# Altium schematic sheet 主控板20160428.SchDoc
size A1
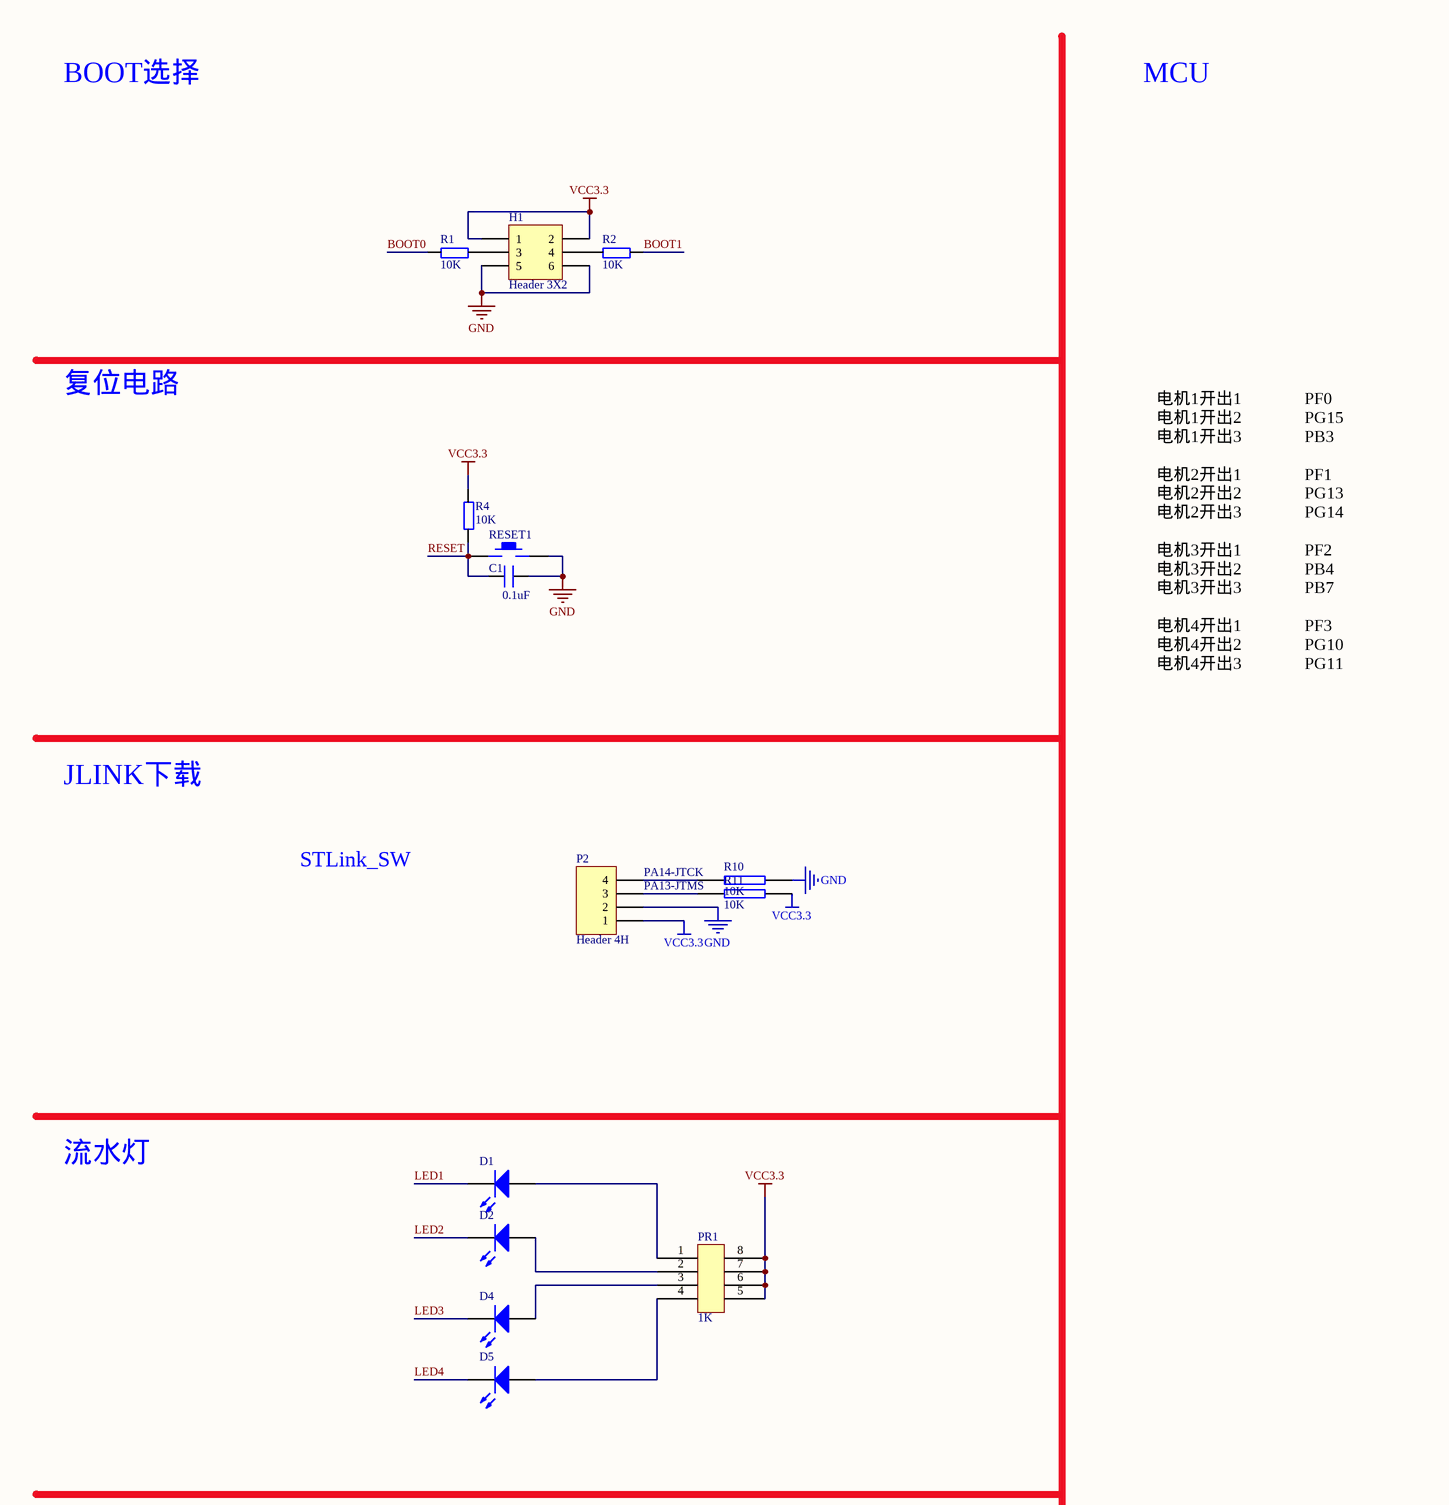
[diagram p0: 主控板20160428.SchDoc, top left]
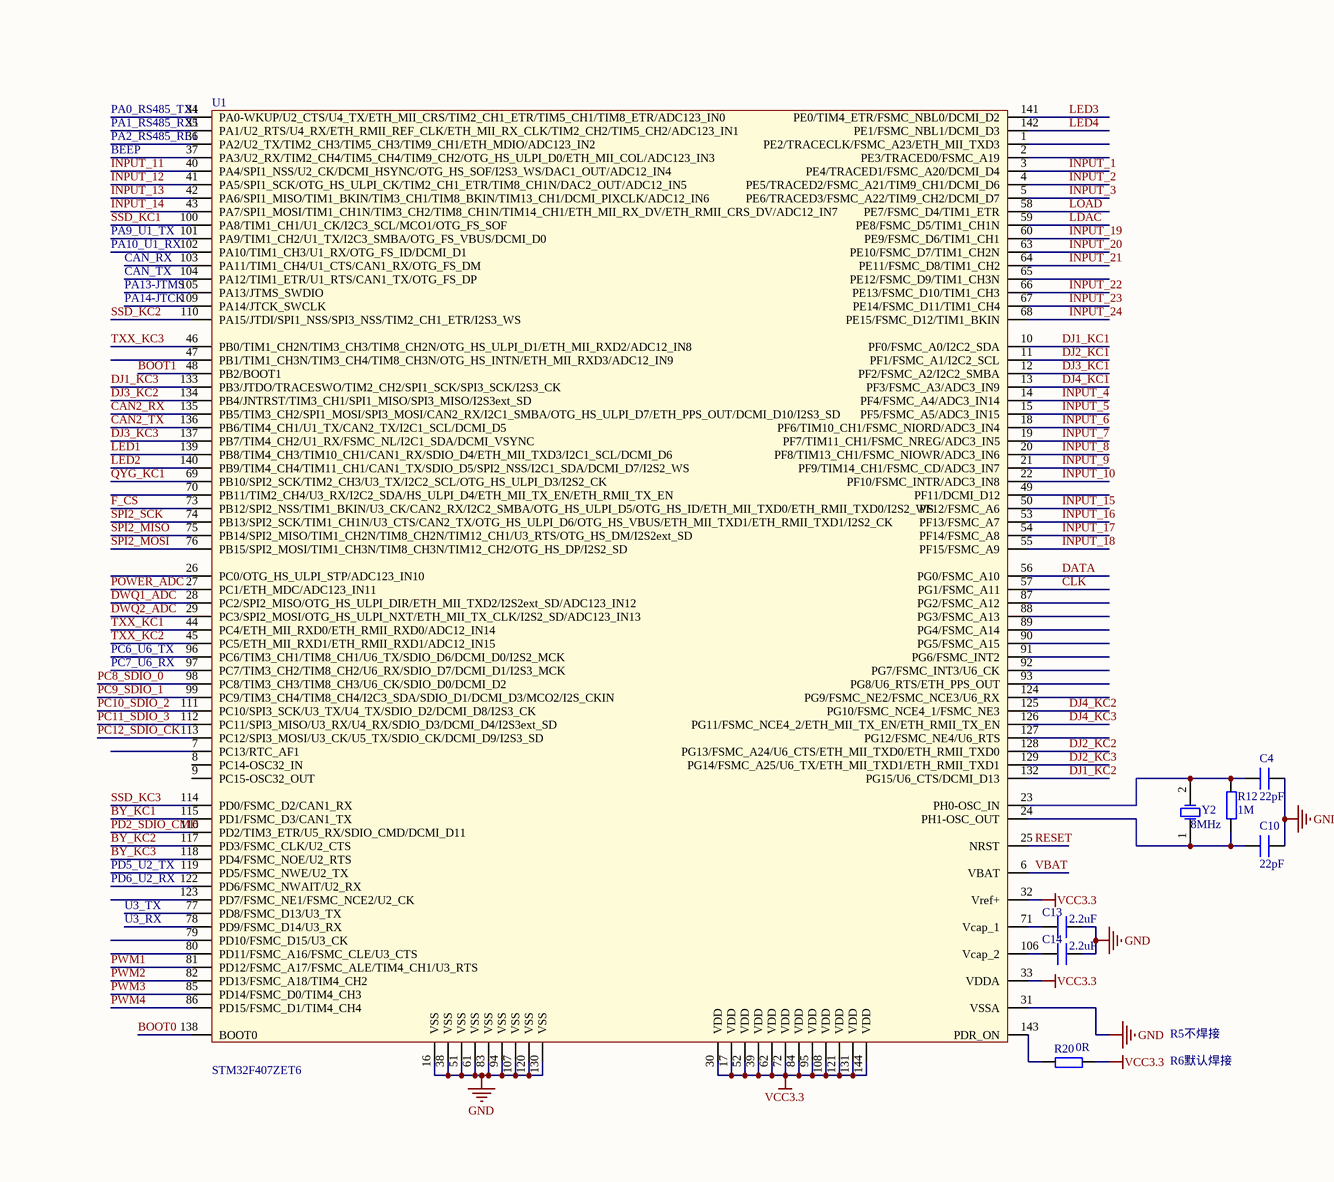
[diagram p1: 主控板20160428.SchDoc, top middle]
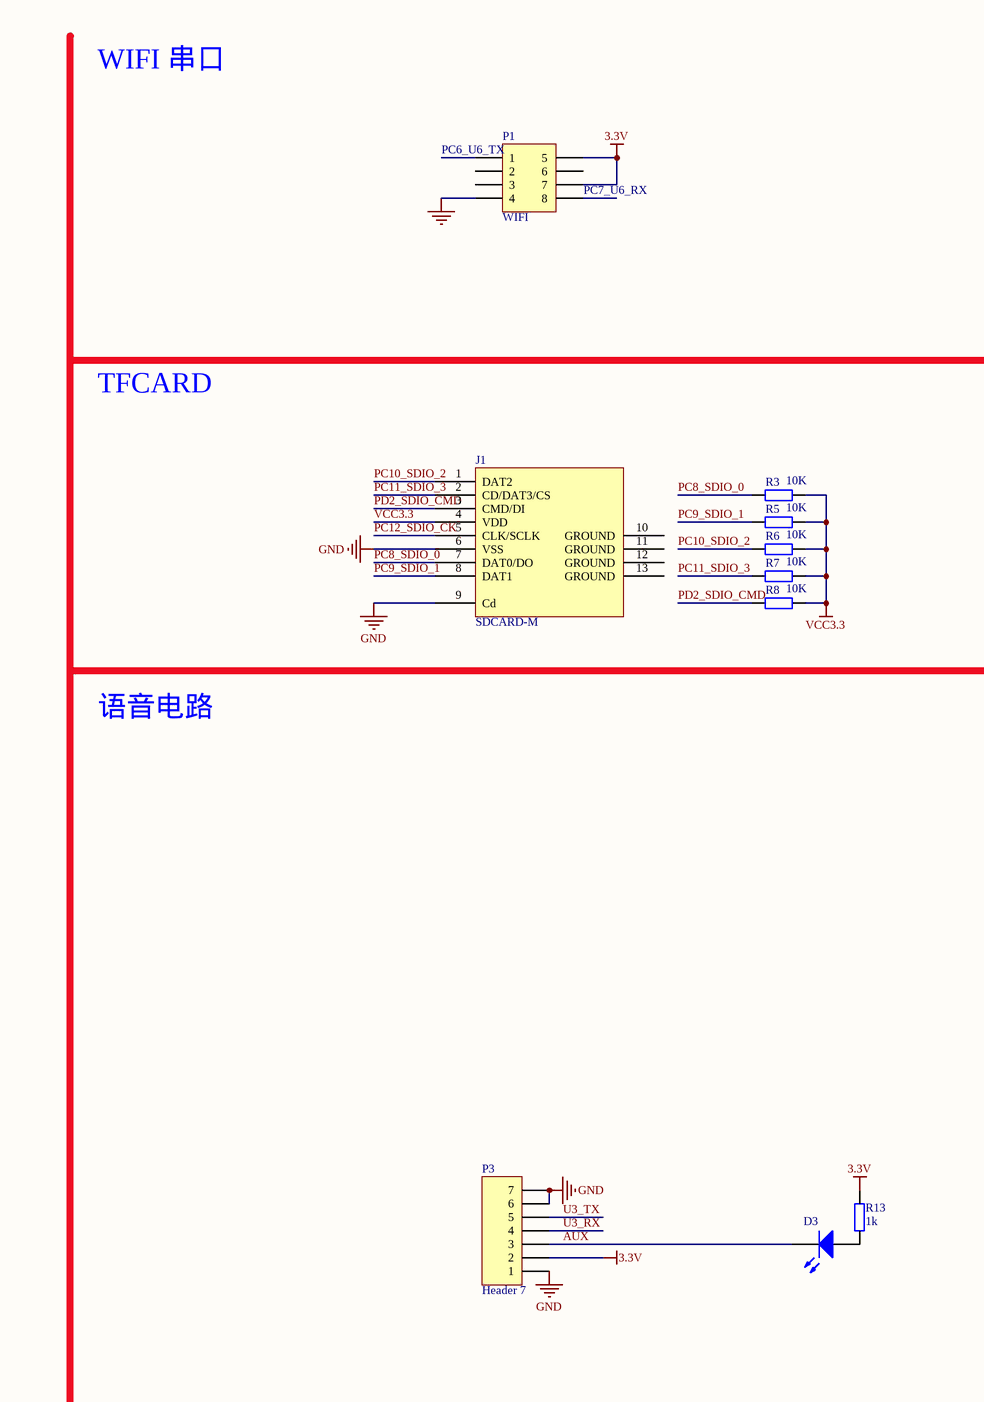
[diagram p2: 主控板20160428.SchDoc, top right]
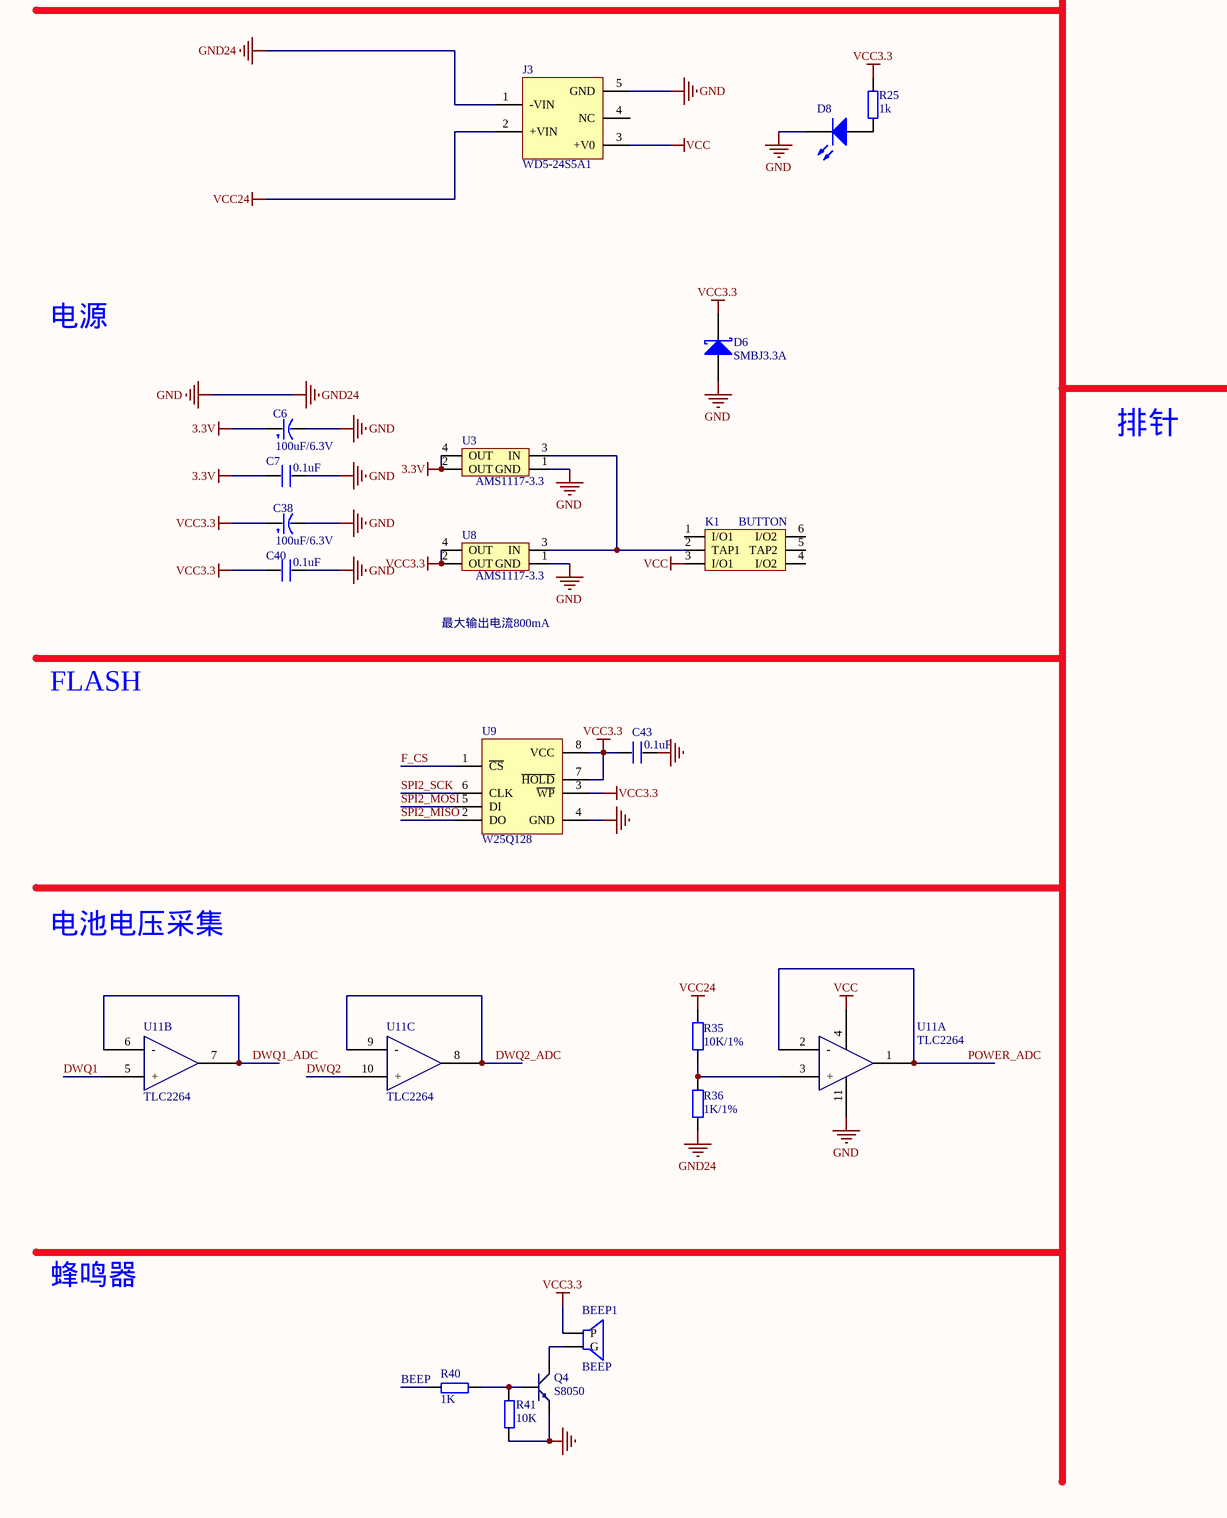
[diagram p3: 主控板20160428.SchDoc, bottom left]
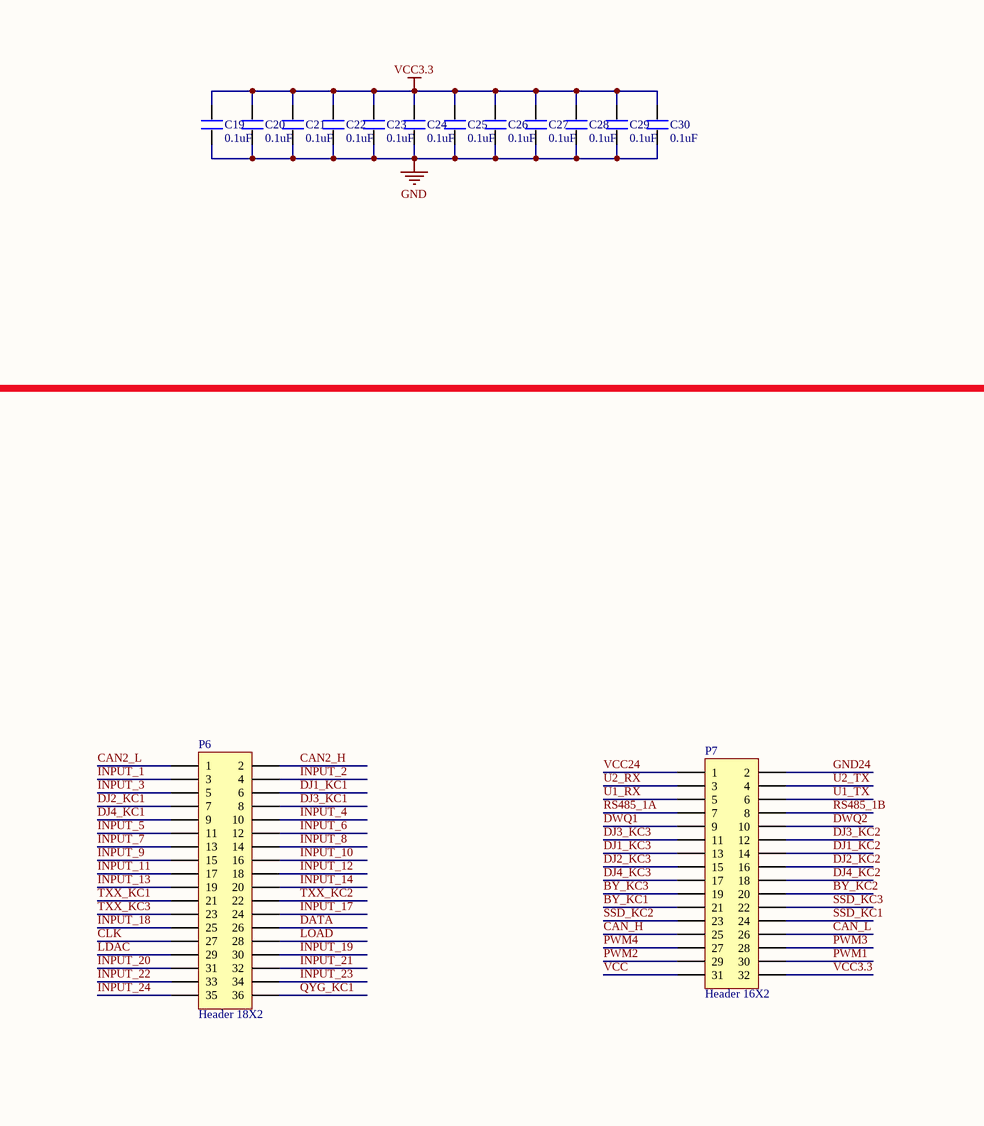
[diagram p4: 主控板20160428.SchDoc, bottom middle]
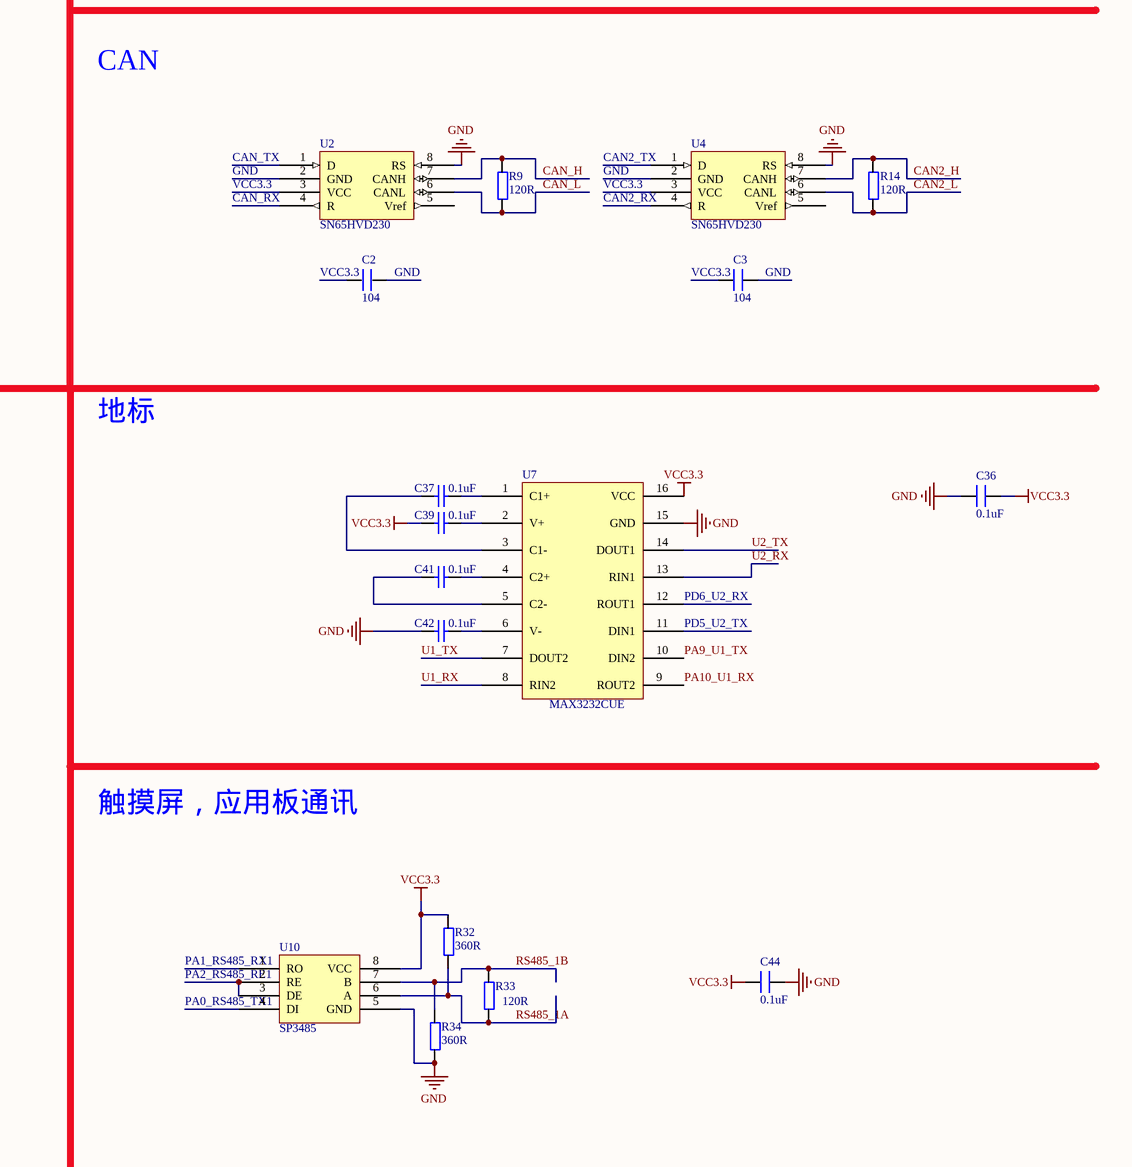
[diagram p5: 主控板20160428.SchDoc, bottom right]

## Parts
BEEP1  BEEP  [BELL-5]
C1  0.1uF  [C0805]
C2  104  [C0805]
C3  104  [C0805]
C4  22pF  [C0805]
C6  100uF/6.3V  [3216]
C7  0.1uF  [C0805]
C10  22pF  [C0805]
C13  2.2uF  [C0805]
C14  2.2uF  [C0805]
C19  0.1uF  [C0805]
C20  0.1uF  [C0805]
C21  0.1uF  [C0805]
C22  0.1uF  [C0805]
C23  0.1uF  [C0805]
C24  0.1uF  [C0805]
C25  0.1uF  [C0805]
C26  0.1uF  [C0805]
C27  0.1uF  [C0805]
C28  0.1uF  [C0805]
C29  0.1uF  [C0805]
C30  0.1uF  [C0805]
C36  0.1uF  [C0805]
C37  0.1uF  [C0805]
C38  100uF/6.3V  [3216]
C39  0.1uF  [C0805]
C40  0.1uF  [C0805]
C41  0.1uF  [C0805]
C42  0.1uF  [C0805]
C43  0.1uF  [C0805]
C44  0.1uF  [C0805]
D1  LED0  [LC-0805_LED_S1]  (value not drawn)
D2  LED0  [LC-0805_LED_S1]  (value not drawn)
D3  LED0  [LC-0805_LED_S1]  (value not drawn)
D4  LED0  [LC-0805_LED_S1]  (value not drawn)
D5  LED0  [LC-0805_LED_S1]  (value not drawn)
D6  SMBJ3.3A  [SMB(DO-214AA)_S1]
D8  LED0  [LC-0805_LED_S1]  (value not drawn)
H1  Header 3X2  [HDR2X3]
J1  SDCARD-M  [SDCARD-M]
J3  WD5-24S5A1  [WD5-24S3V3]
K1  BUTTON  [BTN8.5*8.5]
P1  WIFI  [HDR2X4_CEN]
P2  Header 4H  [IDE4]
P3  Header 7  [AS50-T27]
P6  Header 18X2  [HDR2X18]
P7  Header 16X2  [HDR2X16]
PR1  1K  [TPPZ]
Q4  S8050  [SOT-23R]
R1  10K  [0805]
R2  10K  [0805]
R3  10K  [0805]
R4  10K  [0805]
R5  10K  [0805]
R6  10K  [0805]
R7  10K  [0805]
R8  10K  [0805]
R9  120R  [0805]
R10  10K  [0805]
R11  10K  [0805]
R12  1M  [0805]
R13  1k  [0805]
R14  120R  [0805]
R20  0R  [0805]
R25  1k  [0805]
R32  360R  [0805]
R33  120R  [0805]
R34  360R  [0805]
R35  10K/1%  [0805]
R36  1K/1%  [0805]
R40  1K  [0805]
R41  10K  [0805]
RESET1  KEY_M  [SW_PB2_A1]  (value not drawn)
U1  STM32F407ZET6  [LQFP144]
U2  SN65HVD230  [LC-SOIC-8_150mil]
U3  AMS1117-3.3  [SOT-223]
U4  SN65HVD230  [LC-SOIC-8_150mil]
U7  MAX3232CUE  [SO-16]
U8  AMS1117-3.3  [SOT-223]
U9  W25Q128  [SOIC8_W]
U10  SP3485  [SO-8]
U11  TLC2264  [SO-14]  (parts A,B,C of 4)
Y2  8MHz  [XTAL_US]

## Nets
3.3V: C6.1(VCC) C7.2 P1.5 P1.7 P3.2 R13.1 U3.2(OUT) U3.4(OUT)
GND: C1.2 C2.2 C3.2 C4.1 C6.2(GND) C7.1 C10.1 C13.2 C14.2 C19.1 C20.1 C21.1 C22.1 C23.1 C24.1 C25.1 C26.1 C27.1 C28.1 C29.1 C30.1 C36.1 C38.2(GND) C40.1 C42.2 C43.2 C44.2 D6.2(A) D8.K H1.5 H1.6 J1.6(VSS) J1.9(Cd) J3.1(-VIN) J3.5(GND) P1.4 P2.2 P3.1 P3.6 P3.7 P7.2 Q4.1(E) R10.1 R34.1 R36.1 R41.1 RESET1.2 U1.16(VSS) U1.31(VSSA) U1.38(VSS) U1.51(VSS) U1.61(VSS) U1.83(VSS) U1.94(VSS) U1.107(VSS) U1.120(VSS) U1.130(VSS) U2.2(GND) U2.8(RS) U3.1(GND) U4.2(GND) U4.8(RS) U7.15(GND) U8.1(GND) U9.4(GND) U10.5(GND) U11.11(GND)  [also labelled GND24]
VCC: J3.3(+V0) K1.3(I/O1) P7.31 U11.4(VCC)
VCC3.3: BEEP1.1(P) C2.1 C3.1 C19.2 C20.2 C21.2 C22.2 C23.2 C24.2 C25.2 C26.2 C27.2 C28.2 C29.2 C30.2 C36.2 C38.1(VCC) C39.2 C40.2 C43.1 C44.1 D6.1(K) H1.1 H1.2 J1.4(VDD) P2.1 P7.32 PR1.5 PR1.6 PR1.7 PR1.8 R3.2 R4.2 R5.2 R6.2 R7.2 R8.2 R11.1 R20.2 R25.1 R32.2 U1.17(VDD) U1.30(VDD) U1.32(Vref+) U1.33(VDDA) U1.39(VDD) U1.52(VDD) U1.62(VDD) U1.72(VDD) U1.84(VDD) U1.95(VDD) U1.108(VDD) U1.121(VDD) U1.131(VDD) U1.144(VDD) U2.3(VCC) U4.3(VCC) U7.16(VCC) U8.2(OUT) U8.4(OUT) U9.3(~{WP}) U9.7(~{HOLD}) U9.8(VCC) U10.8(VCC)
VCC24: J3.2(+VIN) P7.1 R35.2
AUX: D3.K P3.3
BEEP: R40.1 U1.37(PA3/U2_RX/TIM2_CH4/TIM5_CH4/TIM9_CH2/OTG_HS_ULPI_D0/ETH_MII_COL/ADC123_IN3)
BOOT0: R1.1 U1.138(BOOT0)
BOOT1: R2.2 U1.48(PB2/BOOT1)
BY_KC1: P7.21 U1.115(PD1/FSMC_D3/CAN1_TX)
BY_KC2: P7.20 U1.117(PD3/FSMC_CLK/U2_CTS)
BY_KC3: P7.19 U1.118(PD4/FSMC_NOE/U2_RTS)
CAN2_H: P6.2 R14.2 U4.7(CANH)
CAN2_L: P6.1 R14.1 U4.6(CANL)
CAN2_RX: U1.135(PB5/TIM3_CH2/SPI1_MOSI/SPI3_MOSI/CAN2_RX/I2C1_SMBA/OTG_HS_ULPI_D7/ETH_PPS_OUT/DCMI_D10/I2S3_SD) U4.4(R)
CAN2_TX: U1.136(PB6/TIM4_CH1/U1_TX/CAN2_TX/I2C1_SCL/DCMI_D5) U4.1(D)
CAN_H: P7.25 R9.2 U2.7(CANH)
CAN_L: P7.26 R9.1 U2.6(CANL)
CAN_RX: U1.103(PA11/TIM1_CH4/U1_CTS/CAN1_RX/OTG_FS_DM) U2.4(R)
CAN_TX: U1.104(PA12/TIM1_ETR/U1_RTS/CAN1_TX/OTG_FS_DP) U2.1(D)
CLK: P6.27 U1.57(PG1/FSMC_A11)
DATA: P6.26 U1.56(PG0/FSMC_A10)
DJ1_KC1: P6.6 U1.10(PF0/FSMC_A0/I2C2_SDA)
DJ1_KC2: P7.14 U1.132(PG15/U6_CTS/DCMI_D13)
DJ1_KC3: P7.13 U1.133(PB3/JTDO/TRACESWO/TIM2_CH2/SPI1_SCK/SPI3_SCK/I2S3_CK)
DJ2_KC1: P6.7 U1.11(PF1/FSMC_A1/I2C2_SCL)
DJ2_KC2: P7.16 U1.128(PG13/FSMC_A24/U6_CTS/ETH_MII_TXD0/ETH_RMII_TXD0)
DJ2_KC3: P7.15 U1.129(PG14/FSMC_A25/U6_TX/ETH_MII_TXD1/ETH_RMII_TXD1)
DJ3_KC1: P6.8 U1.12(PF2/FSMC_A2/I2C2_SMBA)
DJ3_KC2: P7.12 U1.134(PB4/JNTRST/TIM3_CH1/SPI1_MISO/SPI3_MISO/I2S3ext_SD)
DJ3_KC3: P7.11 U1.137(PB7/TIM4_CH2/U1_RX/FSMC_NL/I2C1_SDA/DCMI_VSYNC)
DJ4_KC1: P6.9 U1.13(PF3/FSMC_A3/ADC3_IN9)
DJ4_KC2: P7.18 U1.125(PG10/FSMC_NCE4_1/FSMC_NE3)
DJ4_KC3: P7.17 U1.126(PG11/FSMC_NCE4_2/ETH_MII_TX_EN/ETH_RMII_TX_EN)
DWQ1: P7.9 U11.5(+)
DWQ1_ADC: U1.28(PC2/SPI2_MISO/OTG_HS_ULPI_DIR/ETH_MII_TXD2/I2S2ext_SD/ADC123_IN12) U11.6(-) U11.7(2OUT)
DWQ2: P7.10 U11.10(+)
DWQ2_ADC: U1.29(PC3/SPI2_MOSI/OTG_HS_ULPI_NXT/ETH_MII_TX_CLK/I2S2_SD/ADC123_IN13) U11.8(3OUT) U11.9(-)
F_CS: U1.73(PB12/SPI2_NSS/TIM1_BKIN/U3_CK/CAN2_RX/I2C2_SMBA/OTG_HS_ULPI_D5/OTG_HS_ID/ETH_MII_TXD0/ETH_RMII_TXD0/I2S2_WS) U9.1(~{CS})
INPUT_1: P6.3 U1.3(PE4/TRACED1/FSMC_A20/DCMI_D4)
INPUT_2: P6.4 U1.4(PE5/TRACED2/FSMC_A21/TIM9_CH1/DCMI_D6)
INPUT_3: P6.5 U1.5(PE6/TRACED3/FSMC_A22/TIM9_CH2/DCMI_D7)
INPUT_4: P6.10 U1.14(PF4/FSMC_A4/ADC3_IN14)
INPUT_5: P6.11 U1.15(PF5/FSMC_A5/ADC3_IN15)
INPUT_6: P6.12 U1.18(PF6/TIM10_CH1/FSMC_NIORD/ADC3_IN4)
INPUT_7: P6.13 U1.19(PF7/TIM11_CH1/FSMC_NREG/ADC3_IN5)
INPUT_8: P6.14 U1.20(PF8/TIM13_CH1/FSMC_NIOWR/ADC3_IN6)
INPUT_9: P6.15 U1.21(PF9/TIM14_CH1/FSMC_CD/ADC3_IN7)
INPUT_10: P6.16 U1.22(PF10/FSMC_INTR/ADC3_IN8)
INPUT_11: P6.17 U1.40(PA4/SPI1_NSS/U2_CK/DCMI_HSYNC/OTG_HS_SOF/I2S3_WS/DAC1_OUT/ADC12_IN4)
INPUT_12: P6.18 U1.41(PA5/SPI1_SCK/OTG_HS_ULPI_CK/TIM2_CH1_ETR/TIM8_CH1N/DAC2_OUT/ADC12_IN5)
INPUT_13: P6.19 U1.42(PA6/SPI1_MISO/TIM1_BKIN/TIM3_CH1/TIM8_BKIN/TIM13_CH1/DCMI_PIXCLK/ADC12_IN6)
INPUT_14: P6.20 U1.43(PA7/SPI1_MOSI/TIM1_CH1N/TIM3_CH2/TIM8_CH1N/TIM14_CH1/ETH_MII_RX_DV/ETH_RMII_CRS_DV/ADC12_IN7)
INPUT_15: U1.50(PF12/FSMC_A6)
INPUT_16: U1.53(PF13/FSMC_A7)
INPUT_17: P6.24 U1.54(PF14/FSMC_A8)
INPUT_18: P6.25 U1.55(PF15/FSMC_A9)
INPUT_19: P6.30 U1.60(PE9/FSMC_D6/TIM1_CH1)
INPUT_20: P6.31 U1.63(PE10/FSMC_D7/TIM1_CH2N)
INPUT_21: P6.32 U1.64(PE11/FSMC_D8/TIM1_CH2)
INPUT_22: P6.33 U1.66(PE13/FSMC_D10/TIM1_CH3)
INPUT_23: P6.34 U1.67(PE14/FSMC_D11/TIM1_CH4)
INPUT_24: P6.35 U1.68(PE15/FSMC_D12/TIM1_BKIN)
LDAC: P6.29 U1.59(PE8/FSMC_D5/TIM1_CH1N)
LED1: D1.K U1.139(PB8/TIM4_CH3/TIM10_CH1/CAN1_RX/SDIO_D4/ETH_MII_TXD3/I2C1_SCL/DCMI_D6)
LED2: D2.K U1.140(PB9/TIM4_CH4/TIM11_CH1/CAN1_TX/SDIO_D5/SPI2_NSS/I2C1_SDA/DCMI_D7/I2S2_WS)
LED3: D4.K U1.141(PE0/TIM4_ETR/FSMC_NBL0/DCMI_D2)
LED4: D5.K U1.142(PE1/FSMC_NBL1/DCMI_D3)
LOAD: P6.28 U1.58(PE7/FSMC_D4/TIM1_ETR)
PA0_RS485_TX1: U1.34(PA0-WKUP/U2_CTS/U4_TX/ETH_MII_CRS/TIM2_CH1_ETR/TIM5_CH1/TIM8_ETR/ADC123_IN0) U10.4(DI)
PA1_RS485_RX1: U1.35(PA1/U2_RTS/U4_RX/ETH_RMII_REF_CLK/ETH_MII_RX_CLK/TIM2_CH2/TIM5_CH2/ADC123_IN1) U10.1(RO)
PA2_RS485_RE1: U1.36(PA2/U2_TX/TIM2_CH3/TIM5_CH3/TIM9_CH1/ETH_MDIO/ADC123_IN2) U10.2(RE) U10.3(DE)
PA9_U1_TX: U1.101(PA9/TIM1_CH2/U1_TX/I2C3_SMBA/OTG_FS_VBUS/DCMI_D0) U7.10(DIN2)
PA10_U1_RX: U1.102(PA10/TIM1_CH3/U1_RX/OTG_FS_ID/DCMI_D1) U7.9(ROUT2)
PA13-JTMS: P2.3 R11.2 U1.105(PA13/JTMS_SWDIO)
PA14-JTCK: P2.4 R10.2 U1.109(PA14/JTCK_SWCLK)
PC6_U6_TX: P1.1 U1.96(PC6/TIM3_CH1/TIM8_CH1/U6_TX/SDIO_D6/DCMI_D0/I2S2_MCK)
PC7_U6_RX: P1.8 U1.97(PC7/TIM3_CH2/TIM8_CH2/U6_RX/SDIO_D7/DCMI_D1/I2S3_MCK)
PC8_SDIO_0: J1.7(DAT0/DO) R3.1 U1.98(PC8/TIM3_CH3/TIM8_CH3/U6_CK/SDIO_D0/DCMI_D2)
PC9_SDIO_1: J1.8(DAT1) R5.1 U1.99(PC9/TIM3_CH4/TIM8_CH4/I2C3_SDA/SDIO_D1/DCMI_D3/MCO2/I2S_CKIN)
PC10_SDIO_2: J1.1(DAT2) R6.1 U1.111(PC10/SPI3_SCK/U3_TX/U4_TX/SDIO_D2/DCMI_D8/I2S3_CK)
PC11_SDIO_3: J1.2(CD/DAT3/CS) R7.1 U1.112(PC11/SPI3_MISO/U3_RX/U4_RX/SDIO_D3/DCMI_D4/I2S3ext_SD)
PC12_SDIO_CK: J1.5(CLK/SCLK) U1.113(PC12/SPI3_MOSI/U3_CK/U5_TX/SDIO_CK/DCMI_D9/I2S3_SD)
PD2_SDIO_CMD: J1.3(CMD/DI) R8.1 U1.116(PD2/TIM3_ETR/U5_RX/SDIO_CMD/DCMI_D11)
PD5_U2_TX: U1.119(PD5/FSMC_NWE/U2_TX) U7.11(DIN1)
PD6_U2_RX: U1.122(PD6/FSMC_NWAIT/U2_RX) U7.12(ROUT1)
POWER_ADC: U1.27(PC1/ETH_MDC/ADC123_IN11) U11.1(1OUT) U11.2(-)
PWM1: P7.30 U1.81(PD12/FSMC_A17/FSMC_ALE/TIM4_CH1/U3_RTS)
PWM2: P7.29 U1.82(PD13/FSMC_A18/TIM4_CH2)
PWM3: P7.28 U1.85(PD14/FSMC_D0/TIM4_CH3)
PWM4: P7.27 U1.86(PD15/FSMC_D1/TIM4_CH4)
QYG_KC1: P6.36 U1.69(PB10/SPI2_SCK/TIM2_CH3/U3_TX/I2C2_SCL/OTG_HS_ULPI_D3/I2S2_CK)
RESET: C1.1 R4.1 RESET1.1 U1.25(NRST)
RS485_1A: P7.7 R32.1 R33.1 U10.6(A)
RS485_1B: P7.8 R33.2 R34.2 U10.7(B)
SPI2_MISO: U1.75(PB14/SPI2_MISO/TIM1_CH2N/TIM8_CH2N/TIM12_CH1/U3_RTS/OTG_HS_DM/I2S2ext_SD) U9.2(DO)
SPI2_MOSI: U1.76(PB15/SPI2_MOSI/TIM1_CH3N/TIM8_CH3N/TIM12_CH2/OTG_HS_DP/I2S2_SD) U9.5(DI)
SPI2_SCK: U1.74(PB13/SPI2_SCK/TIM1_CH1N/U3_CTS/CAN2_TX/OTG_HS_ULPI_D6/OTG_HS_VBUS/ETH_MII_TXD1/ETH_RMII_TXD1/I2S2_CK) U9.6(CLK)
SSD_KC1: P7.24 U1.100(PA8/TIM1_CH1/U1_CK/I2C3_SCL/MCO1/OTG_FS_SOF)
SSD_KC2: P7.23 U1.110(PA15/JTDI/SPI1_NSS/SPI3_NSS/TIM2_CH1_ETR/I2S3_WS)
SSD_KC3: P7.22 U1.114(PD0/FSMC_D2/CAN1_RX)
TXX_KC1: P6.21 U1.44(PC4/ETH_MII_RXD0/ETH_RMII_RXD0/ADC12_IN14)
TXX_KC2: P6.22 U1.45(PC5/ETH_MII_RXD1/ETH_RMII_RXD1/ADC12_IN15)
TXX_KC3: P6.23 U1.46(PB0/TIM1_CH2N/TIM3_CH3/TIM8_CH2N/OTG_HS_ULPI_D1/ETH_MII_RXD2/ADC12_IN8)
U1_RX: P7.5 U7.8(RIN2)
U1_TX: P7.6 U7.7(DOUT2)
U2_RX: P7.3 U7.13(RIN1)
U2_TX: P7.4 U7.14(DOUT1)
U3_RX: P3.4 U1.78(PD9/FSMC_D14/U3_RX)
U3_TX: P3.5 U1.77(PD8/FSMC_D13/U3_TX)
VBAT: U1.6(VBAT)
NetBEEP1_2: BEEP1.2(G) Q4.3(C)
NetC4_2: C4.2 R12.2 U1.23(PH0-OSC_IN) Y2.2(OSC2)
NetC10_2: C10.2 R12.1 U1.24(PH1-OSC_OUT) Y2.1(OSC1)
NetC13_1: C13.1 U1.71(Vcap_1)
NetC14_1: C14.1 U1.106(Vcap_2)
NetC37_1: C37.1 U7.1(C1+)
NetC37_2: C37.2 U7.3(C1-)
NetC39_1: C39.1 U7.2(V+)
NetC41_1: C41.1 U7.4(C2+)
NetC41_2: C41.2 U7.5(C2-)
NetC42_1: C42.1 U7.6(V-)
NetD1_A: D1.A PR1.1
NetD2_A: D2.A PR1.2
NetD3_A: D3.A R13.2
NetD4_A: D4.A PR1.3
NetD5_A: D5.A PR1.4
NetD8_A: D8.A R25.2
NetH1_3: H1.3 R1.2
NetH1_4: H1.4 R2.1
NetK1_2: K1.2(TAP1) U3.3(IN) U8.3(IN)
NetQ4_2: Q4.2(B) R40.2 R41.2
NetR20_1: R20.1 U1.143(PDR_ON)
NetR35_1: R35.1 R36.2 U11.3(+)

Not connected (* = marked no-connect by the designer): J1 10(GROUND) 11(GROUND) 12(GROUND) 13(GROUND); J3 4(NC); K1 1(I/O1) 4(I/O2) 5(TAP2) 6(I/O2); P1 2 3 6; U1 1(PE2/TRACECLK/FSMC_A23/ETH_MII_TXD3) 2(PE3/TRACED0/FSMC_A19) 7(PC13/RTC_AF1) 8(PC14-OSC32_IN) 9(PC15-OSC32_OUT) 26(PC0/OTG_HS_ULPI_STP/ADC123_IN10) 47(PB1/TIM1_CH3N/TIM3_CH4/TIM8_CH3N/OTG_HS_INTN/ETH_MII_RXD3/ADC12_IN9) 49(PF11/DCMI_D12) 65(PE12/FSMC_D9/TIM1_CH3N) 70(PB11/TIM2_CH4/U3_RX/I2C2_SDA/HS_ULPI_D4/ETH_MII_TX_EN/ETH_RMII_TX_EN) 79(PD10/FSMC_D15/U3_CK) 80(PD11/FSMC_A16/FSMC_CLE/U3_CTS) 87(PG2/FSMC_A12) 88(PG3/FSMC_A13) 89(PG4/FSMC_A14) 90(PG5/FSMC_A15) 91(PG6/FSMC_INT2) 92(PG7/FSMC_INT3/U6_CK) 93(PG8/U6_RTS/ETH_PPS_OUT) 123(PD7/FSMC_NE1/FSMC_NCE2/U2_CK) 124(PG9/FSMC_NE2/FSMC_NCE3/U6_RX) 127(PG12/FSMC_NE4/U6_RTS); U2 5(Vref); U4 5(Vref)

## Notes on the sheet
- BOOT选择
- MCU
- WIFI 串口
- 复位电路
- TFCARD
- 电机1开出1              PF0
  电机1开出2              PG15
  电机1开出3              PB3
  电机2开出1              PF1
  电机2开出2              PG13
  电机2开出3              PG14
  电机3开出1              PF2
  电机3开出2              PB4
  电机3开出3              PB7
  电机4开出1              PF3
  电机4开出2              PG10
  电机4开出3              PG11
- 语音电路
- JLINK下载
- STLink_SW
- 流水灯
- R5不焊接
- R6默认焊接
- CAN
- 电源
- 排针
- 地标
- 最大输出电流800mA
- FLASH
- 触摸屏，应用板通讯
- 电池电压采集
- 蜂鸣器

## Library data of the parts
C1 C7 C13 C14 C19-C30 C40 C43 = C
C2-C4 C10 C44 = C_3
C6 C38 = CAP
C36 = C_2
C37 C39 C41 C42 = Cap: Capacitor; Published: 8-Jun-2000; LatestRevisionDate: 17-Jul-2002; LatestRevisionNote: Re-released for DXP Platform.; PackageReference: RAD-0.3; Publisher: Altium Limited; PackageDescription: Radial Cap, Thru-Hole; 2 Leads; 0.3 in Pin Spacing; Value: 0.1uF
D1-D5 D8 = LED0: Typical INFRARED GaAs LED; Published: 8-Jun-2000; LatestRevisionDate: 08-Jul-2005; LatestRevisionNote: Mech Layer 1 removed.; PackageReference: LED-0; Publisher: Altium Limited; PackageDescription: LED; 2 Leads
D6 = Diode 18TQ045: Schottky Rectifier; Note: Terminal 2 is the TAB and is electrically connected to the cathode; Published: 8-Jun-2000; LatestRevisionDate: 17-Jul-2002; LatestRevisionNote: Re-released for DXP Platform.; DatasheetVersion: Dec-1997; PackageVersion: Feb-1998; PackageReference: TO-220AC; Publisher: Altium Limited; PackageDescription: TO, Thru-Hole, Vertical, Heatsink Mounted; 3 In-Line Leads (1 Absent); Pitch 2.54 mm; ComponentLink1Description: Manufacturer Link; ComponentLink1URL: http://www.irf.com/; ComponentLink2Description: Datasheet; ComponentLink2URL: http://www.irf.com/product-info/datasheets/data/18tq.pdf
H1 = Header 3X2: Header, 3-Pin, Dual row; LatestRevisionDate: 17-Jul-2002; LatestRevisionNote: Re-released for DXP Platform.; Publisher: Altium Limited
J1 = SDCARD-M: TF卡槽
J3 = WD5-24S3V3A1
P1 = Header 4X2A: Header, 4-Pin, Dual row; LatestRevisionDate: 17-Jul-2002; LatestRevisionNote: Re-released for DXP Platform.; Publisher: Altium Limited
P2 = Header 4H: Header, 4-Pin, Right Angle; LatestRevisionDate: 17-Jul-2002; LatestRevisionNote: Re-released for DXP Platform.; Publisher: Altium Limited
P3 = Header 7: Header, 7-Pin; LatestRevisionDate: 17-Jul-2002; LatestRevisionNote: Re-released for DXP Platform.; Publisher: Altium Limited
P6 = Header 18X2: Header, 18-Pin, Dual row; LatestRevisionDate: 17-Jul-2002; LatestRevisionNote: Re-released for DXP Platform.; Publisher: Altium Limited
P7 = Header 16X2: Header, 16-Pin, Dual row; LatestRevisionDate: 17-Jul-2002; LatestRevisionNote: Re-released for DXP Platform.; Publisher: Altium Limited
PR1 = PZ
Q4 = NPN: 8050/BCW846/BCW847
R1 R2 = R_1
R3 R5-R8 = Res1: 贴片电阻; Published: 8-Jun-2000; LatestRevisionDate: 17-Jul-2002; LatestRevisionNote: Re-released for DXP Platform.; PackageReference: AXIAL-0.4; Publisher: Altium Limited; Value: 10K
R4 R9 R13 R14 R20 R25 R32-R34 = R_2
R10 R11 = RES2
R12 R40 R41 = R
R35 = Res2: Resistor; Value: 10K; Published: 8-Jun-2000; LatestRevisionDate: 17-Jul-2002; LatestRevisionNote: Re-released for DXP Platform.; PackageReference: AXIAL-0.4; Publisher: Altium Limited; PackageDescription: Axial Device, Thru-Hole; 2 Leads; 0.4 in Pin Spacing
R36 = Res2: Resistor; Value: 1K; Published: 8-Jun-2000; LatestRevisionDate: 17-Jul-2002; LatestRevisionNote: Re-released for DXP Platform.; PackageReference: AXIAL-0.4; Publisher: Altium Limited; PackageDescription: Axial Device, Thru-Hole; 2 Leads; 0.4 in Pin Spacing
U2 U4 = SN65HVD230D
U3 U8 = AMS1117
U9 = W25QXX: SPI FLASH; Memory: 64M bit
Y2 = XTAL: Crystal Oscillator; Published: 8-Jun-2000; LatestRevisionDate: 17-Jul-2002; LatestRevisionNote: Re-released for DXP Platform.; Publisher: Altium Limited